# Altium schematic sheet Scheme.SchDoc
size A2
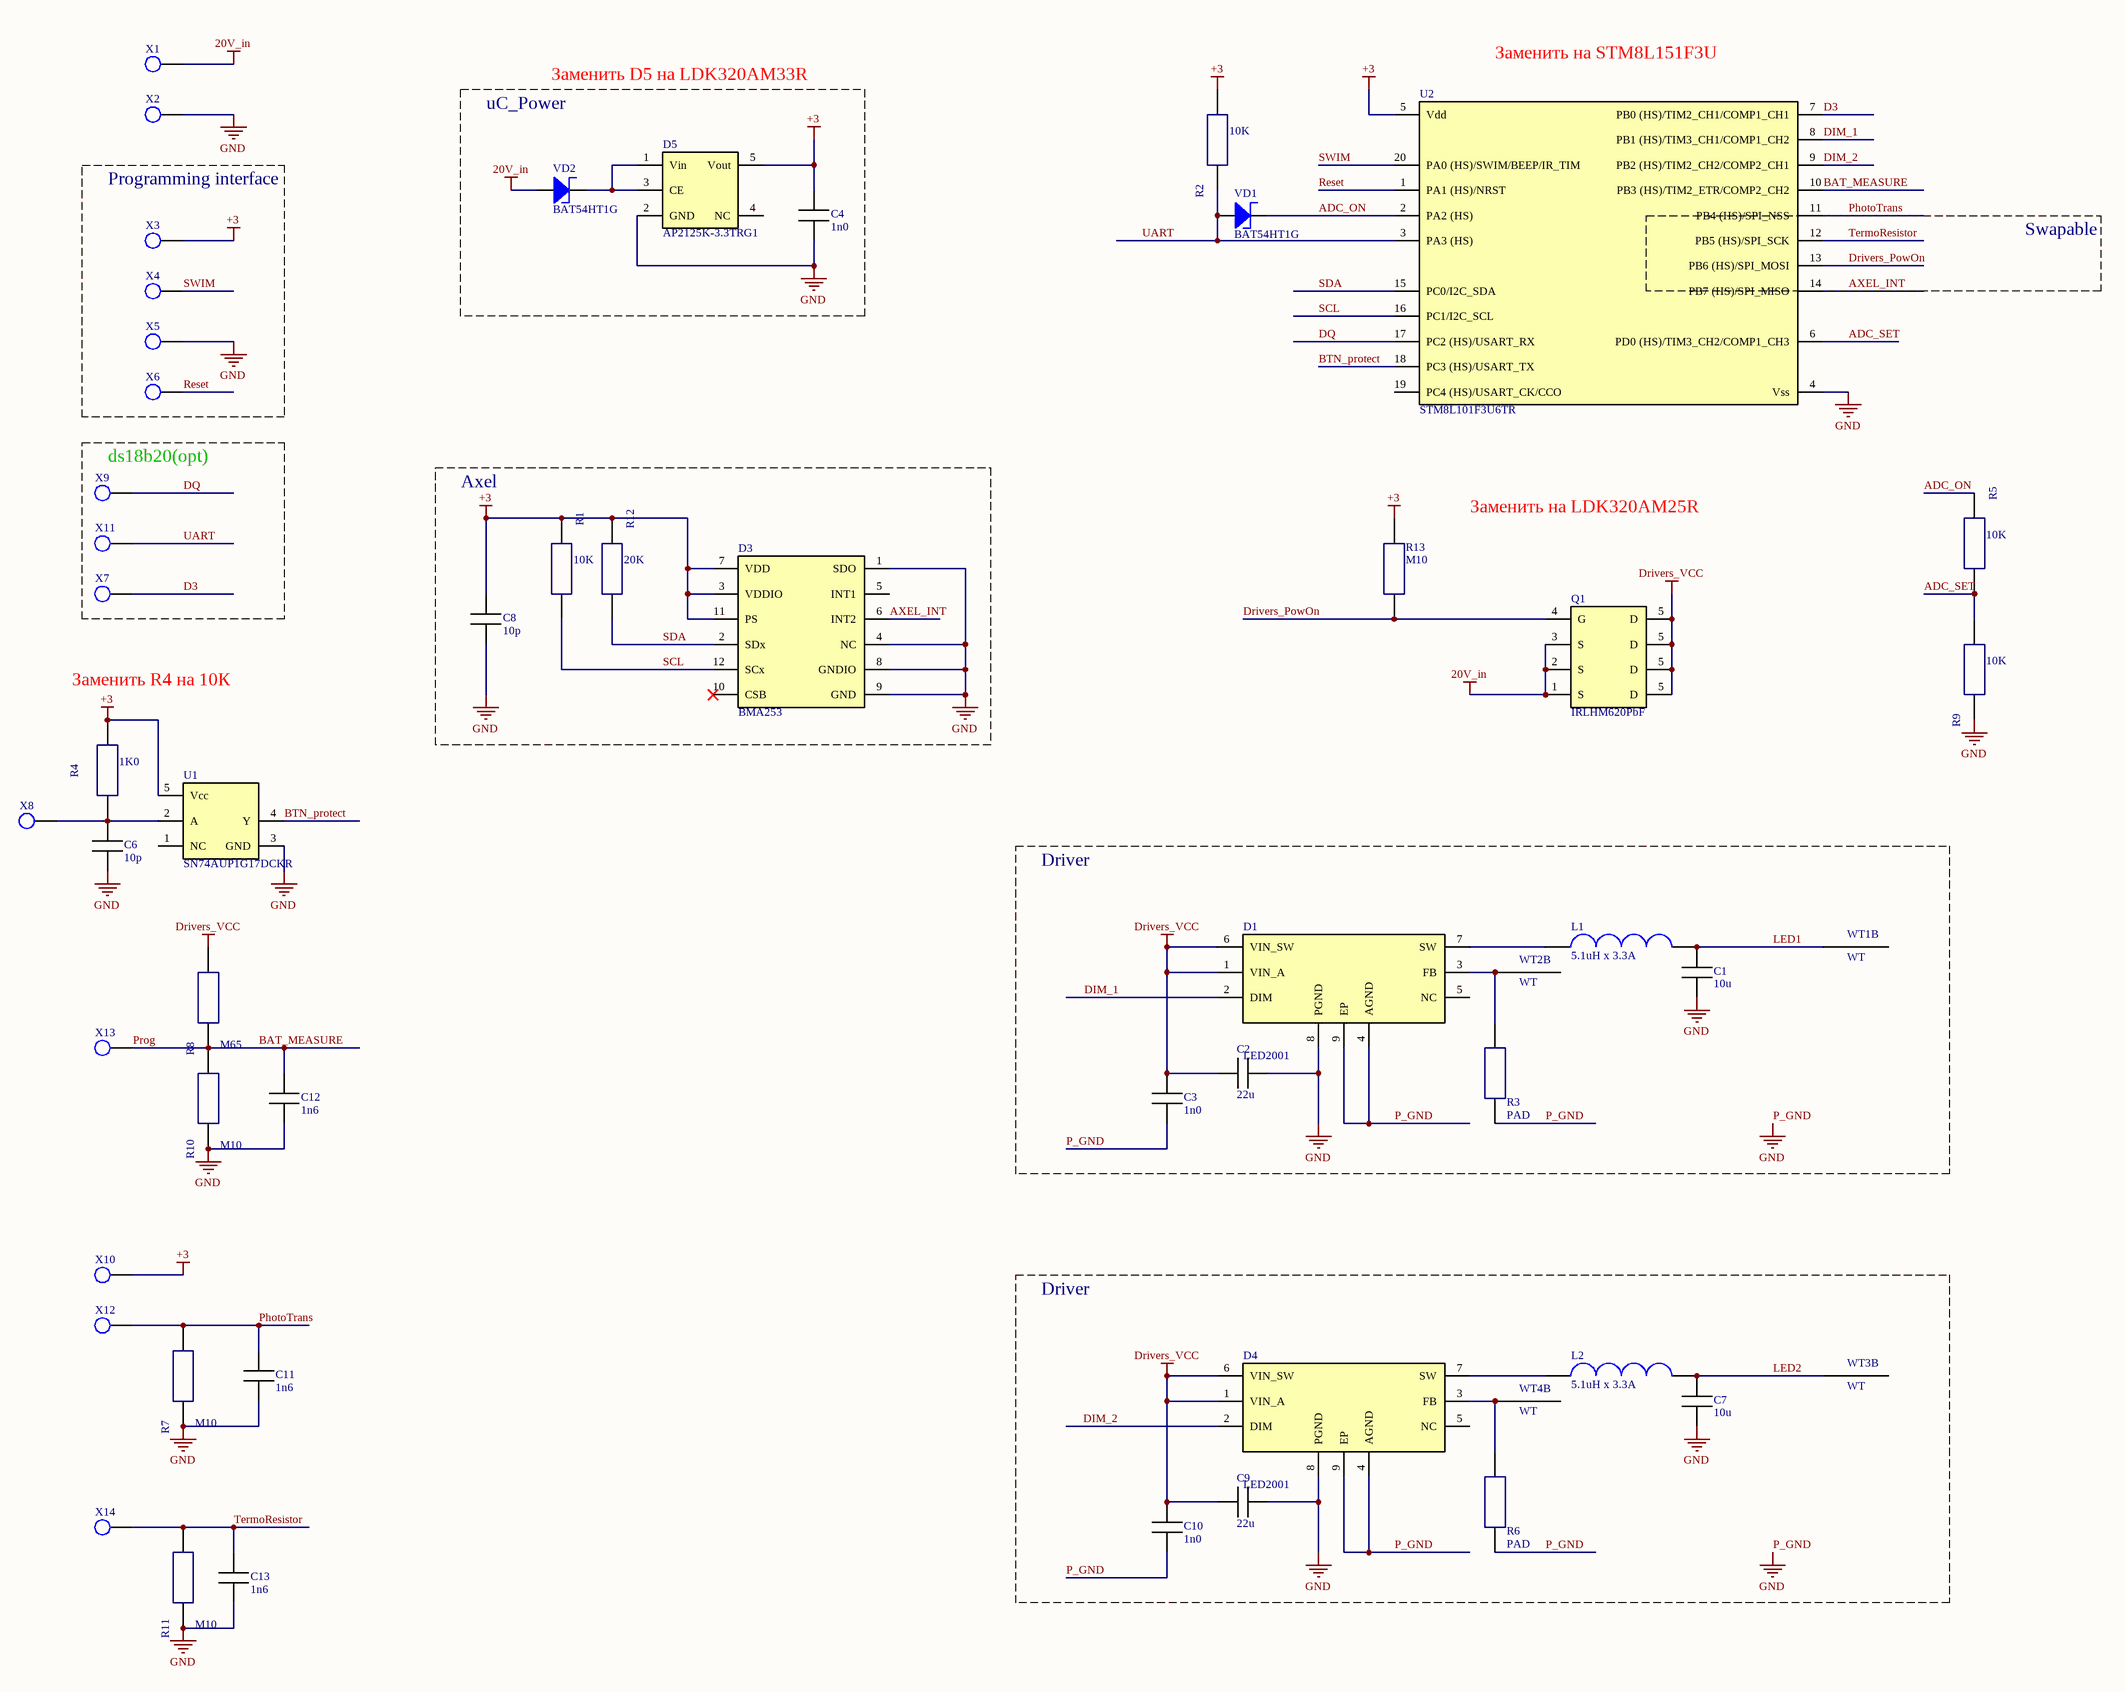
[diagram p0: Scheme.SchDoc]

## Parts
C1  10u  [Cap 0603]
C2  22u  [Cap 1206]
C3  1n0  [Cap 0603]
C4  1n0  [Cap 0603]
C6  10p  [Cap 0603]
C7  10u  [Cap 0603]
C8  10p  [Cap 0603]
C9  22u  [Cap 1206]
C10  1n0  [Cap 0603]
C11  1n6  [Cap 0603]
C12  1n6  [Cap 0603]
C13  1n6  [Cap 0603]
D1  LED2001  [VQFPN-8 4x4]
D3  BMA253  [LGA-12 2x2x0.9]
D4  LED2001  [VQFPN-8 4x4]
D5  AP2125K-3.3TRG1  [SOT23-5]
L1  value 5.1uH x 3.3A  [ASPI-6045S-5R1N-T]  (hidden comment: 51)
L2  value 5.1uH x 3.3A  [ASPI-6045S-5R1N-T]  (hidden comment: 51)
Q1  value IRLHM620PbF  [PQFN-8 3.3x3.3]  (hidden comment: IRLHM620)
R1  value 10K  [R0603 5%]  (hidden comment: 103)
R2  value 10K  [R0603 5%]  (hidden comment: 103)
R3  PAD  [Resistor 1206]
R4  value 1K0  [R0603 5%]  (hidden comment: 102)
R5  value 10K  [R0603 5%]  (hidden comment: 103)
R6  PAD  [Resistor 1206]
R7  value M10  [R0603 5%]  (hidden comment: 104)
R8  value M65  [R0603 5%]  (hidden comment: 654)
R9  value 10K  [R0603 5%]  (hidden comment: 103)
R10  value M10  [R0603 5%]  (hidden comment: 104)
R11  value M10  [R0603 5%]  (hidden comment: 104)
R12  value 20K  [R0603 5%]  (hidden comment: 203)
R13  value M10  [R0603 5%]  (hidden comment: 104)
U1  value SN74AUP1G17DCKR  [SC-70-5]  (hidden comment: SN74AUP)
U2  value STM8L101F3U6TR  [UFQFPN20 3x3x0.5]  (hidden comment: STM8L101)
VD1  value BAT54HT1G  [SOD323]  (hidden comment: JV)
VD2  value BAT54HT1G  [SOD323]  (hidden comment: JV)
WT1  value WT  [WT]  (hidden comment: *)  (part B of 2)
WT2  value WT  [WT]  (hidden comment: *)  (part B of 2)
WT3  value WT  [WT]  (hidden comment: *)  (part B of 2)
WT4  value WT  [WT]  (hidden comment: *)  (part B of 2)
X1  *  [TP 0.8mm]  (value not drawn)  (no BOM)
X2  *  [TP 0.8mm]  (value not drawn)  (no BOM)
X3  *  [TP 0.8mm]  (value not drawn)  (no BOM)
X4  *  [TP 0.8mm]  (value not drawn)  (no BOM)
X5  *  [TP 0.8mm]  (value not drawn)  (no BOM)
X6  *  [TP 0.8mm]  (value not drawn)  (no BOM)
X7  *  [TP 0.8mm]  (value not drawn)  (no BOM)
X8  *  [TP 0.8mm]  (value not drawn)  (no BOM)
X9  *  [TP 0.8mm]  (value not drawn)  (no BOM)
X10  *  [TP 0.8mm]  (value not drawn)  (no BOM)
X11  *  [TP 0.8mm]  (value not drawn)  (no BOM)
X12  *  [TP 0.8mm]  (value not drawn)  (no BOM)
X13  *  [TP 0.8mm]  (value not drawn)  (no BOM)
X14  *  [TP 0.8mm]  (value not drawn)  (no BOM)

## Nets
20V_in: Q1.1(S) Q1.2(S) Q1.3(S) VD2.2 X1.1
+3: C4.2 C8.2 D3.3(VDDIO) D3.7(VDD) D3.11(PS) D5.5(Vout) R1.1 R2.2 R4.2 R12.1 R13.2 U1.5(Vcc) U2.5(Vdd) X3.1 X10.1
Drivers_VCC: C2.1 C3.2 C9.1 C10.2 D1.1(VIN_A) D1.6(VIN_SW) D4.1(VIN_A) D4.6(VIN_SW) Q1.5(D) R8.2
P_GND: C1.1 C2.2 C3.1 C4.1 C6.1 C7.1 C8.1 C9.2 C10.1 C11.1 C12.1 C13.1 D1.4(AGND) D1.8(PGND) D1.9(EP) D3.1(SDO) D3.4(NC) D3.8(GNDIO) D3.9(GND) D4.4(AGND) D4.8(PGND) D4.9(EP) D5.2(GND) R3.1 R6.1 R7.1 R9.1 R10.1 R11.1 U1.3(GND) U2.4(Vss) X2.1 X5.1  [also labelled GND]
ADC_ON: R5.1 U2.2(PA2_(HS)) VD1.1
ADC_SET: R5.2 R9.2 U2.6(PD0_(HS)/TIM3_CH2/COMP1_CH3)
AXEL_INT: D3.6(INT2) U2.14(PB7_(HS)/SPI_MISO)
BAT_MEASURE: C12.2 R8.1 R10.2 U2.10(PB3_(HS)/TIM2_ETR/COMP2_CH2) X13.1  [also labelled Prog]
BTN_protect: U1.4(Y) U2.18(PC3_(HS)/USART_TX)
D3: U2.7(PB0_(HS)/TIM2_CH1/COMP1_CH1) X7.1
DIM_1: D1.2(DIM) U2.8(PB1_(HS)/TIM3_CH1/COMP1_CH2)
DIM_2: D4.2(DIM) U2.9(PB2_(HS)/TIM2_CH2/COMP2_CH1)
DQ: U2.17(PC2_(HS)/USART_RX) X9.1
Drivers_PowOn: Q1.4(G) R13.1 U2.13(PB6_(HS)/SPI_MOSI)
LED1: C1.2 L1.2 WT1.1
LED2: C7.2 L2.2 WT3.1
PhotoTrans: C11.2 R7.2 U2.11(PB4_(HS)/SPI_NSS) X12.1
Reset: U2.1(PA1_(HS)/NRST) X6.1
SCL: D3.12(SCx) R1.2 U2.16(PC1/I2C_SCL)
SDA: D3.2(SDx) R12.2 U2.15(PC0/I2C_SDA)
SWIM: U2.20(PA0_(HS)/SWIM/BEEP/IR_TIM) X4.1
TermoResistor: C13.2 R11.2 U2.12(PB5_(HS)/SPI_SCK) X14.1
UART: R2.1 U2.3(PA3_(HS)) VD1.2 X11.1
NetC6_2: C6.2 R4.1 U1.2(A) X8.1
NetD1_3: D1.3(FB) R3.2 WT2.1
NetD1_7: D1.7(SW) L1.1
NetD4_3: D4.3(FB) R6.2 WT4.1
NetD4_7: D4.7(SW) L2.1
NetD5_1: D5.1(Vin) D5.3(CE) VD2.1

Not connected (* = marked no-connect by the designer): D1 5(NC); D3 5(INT1) 10(CSB)*; D4 5(NC); D5 4(NC); U1 1(NC); U2 19(PC4_(HS)/USART_CK/CCO)

## Notes on the sheet
- uC_Power
- Заменить D5 на LDK320AM33R
- (near U2) Заменить на STM8L151F3U
- Programming interface
- Swapable
- (near X9) ds18b20(opt)
- Axel
- Заменить на LDK320AM25R
- Заменить R4 на 10К
- Driver

## Library data of the parts
C1 C7 = CMP-00038-7: NO; Component Name: Ceramic Capacitor, SMD, 0603, X7R, 10u x 25V 10%; Voltage: 25V; Package: 0603; Value: 10u; Marking: 10u
C2 C9 = CMP-00564-4: NO; Component Name: Ceramic Capacitor, SMD, 1206, X7R, 22uF x 25V; Voltage: 25V; Value: 22u; Marking: 22u; Package: 1206
C3 C4 C10 = CMP-00074-6: 1n x 50V; Component Name: Ceramic Capacitor, SMD, 0603, X7R, 1000p x 50V; Package: 0603; Value: 1n0; Marking: 1n0; Voltage: 50V
C6 C8 = CMP-00036-6: 10p x 25V; Component Name: Ceramic Capacitor, SMD, 0603, X7R, 10p x 25V; Package: 0603; Value: 10p; Marking: 10p; Voltage: 25V
C11-C13 = CMP-00078-6: 1n6 x 50V; Component Name: Ceramic Capacitor, SMD, 0603, X7R, 1600p x 50V; Package: 0603; Value: 1n6; Marking: 1n6; Voltage: 50V
D1 D4 = CMP-00546-6: Component Name: IC, Step-down DC-DC converter , LED2001, VFQFPN-8; Value: LED2001; ComponentLink1Description: Datasheet; Mounting type: SMD; ComponentLink1URL: http://www.st.com/content/ccc/resource/technical/document/datasheet/37/ed/f7/77/d7/ed/4e/84/DM00079085.pdf/files/DM00079085.pdf/jcr:content/translations/en.DM00079085.pdf; Marking: LED2001; Package: VFQFPN-8
D3 = CMP-00712-2: Component Name: Digital triaxial acceleration sensor, BMA253, LGA-12; ComponentLink1URL: http://www.mouser.com/ds/2/783/Bosch_01242017_BMA253-1084829.pdf; Value: BMA253; ComponentLink1Description: Datasheet; Mounting type: SMD; Marking: BMA253; Package: LGA-12
D5 = CMP-00704-3: Component Name: IC,  LDO REGULATOR, AP2125K-3.3TRG1, SOT23-5; Package: SOT23-5; Marking: AP2125K-3.3TRG1; Value: AP2125K-3.3TRG1; ComponentLink1Description: Datasheet; ComponentLink1URL: https://www.diodes.com/assets/Datasheets/AP2125.pdf; Mounting type: SMD
L1 L2 = CMP-00554-3: ASPI-6045S-5R1N-T, 5.1uH x 3.3A; Component Name: Power Inductor,  ASPI-6045S-5R1N-T, 5.1uH x 3.3A; ComponentLink1Description: Datasheet; Mounting type: SMD; ComponentLink1URL: http://www.abracon.com/Magnetics/power/ASPI-6045S.pdf; Marking: 51; Package: 6x6mm
Q1 = CMP-00792-2: IRLHM620PbF; Component Name: HEXFET Power MOSFET, IRLHM620PbF , PQFN-8 3x3MM; ComponentLink1URL: https://www.infineon.com/dgdl/irlhm620pbf.pdf?fileId=5546d462533600a4015356638be325a3; ComponentLink1Description: Datasheet; Mounting type: SMD; Marking: IRLHM620; Package: PQFN-8 3x3
R1 R2 R5 R9 = CMP-00052-5: R 10K; Component Name: Fixed resistor, SMD, 0603, 10K 5%; Package: 0603; Marking: 103
R3 R6 = CMP-00516-5: Value: PAD; Component Name: PAD; Marking: PAD; Package: 1206
R4 = CMP-00040-5: R 1K0; Component Name: Fixed resistor, SMD, 0603, 1K 5%; Package: 0603; Marking: 102
R7 R10 R11 R13 = CMP-00156-5: R M10; Component Name: Fixed resistor, SMD, 0603, 100K 5%; Marking: 104; Package: 0603
R8 = CMP-00565-4: R M65; Component Name: Fixed resistor, SMD, 0603, 650K 5%; Marking: 654; Package: 0603
R12 = CMP-00056-5: R 20K; Component Name: Fixed resistor, SMD, 0603, 20K 5%; Package: 0603; Marking: 203
U1 = SN74AUP1G17DCKR: Component Name: IC, Low-Power Single Schmitt-Trigger Buffer, SN74AUP1G17DCKR, SC-70-5; ComponentLink1URL: http://www.ti.com/lit/ds/symlink/sn74aup1g17.pdf; ComponentLink1Description: Datasheet; Mounting type: SMD; Marking: SN74AUP; Package: SC-70-5
U2 = CMP-03099-1: STM8L101F3U6TR; Component Name: IC, Microcontroller, STM8L101F3U6TR, UFQFPN20; ComponentLink1URL: http://static6.arrow.com/aropdfconversion/a89399d87b205b509839fa3efc4edf58653ca91b/171496178176556cd0022.pdf; ComponentLink1Description: Datasheet; Mounting type: SMD; Marking: STM8L101; Package: UFQFPN20
VD1 VD2 = CMP-00083-4: BAT54HT1G; Component Name: Schottky Barrier Diodes, BAT54HT1G, SOD-323; Marking: JV; Package: SOD-323; ComponentLink1Description: Datasheet; ComponentLink1URL: http://www.onsemi.ru.com/pub_link/Collateral/BAT54HT1-D.PDF; Mounting type: SMD
WT1-WT4 = CMP-00159-3: WT; Component Name: Connector, WT; Marking: *; Package: WT; ComponentLink1Description: Datasheet; ComponentLink1URL: *
X1-X14 = CMP-00326-5: TP 0.8mm; Component Name: Connector, TP 0.8mm; Marking: *; Package: 0.8mm; ComponentLink1Description: Datasheet; ComponentLink1URL: *